# Altium schematic sheet Sheet1.SchDoc
size A4
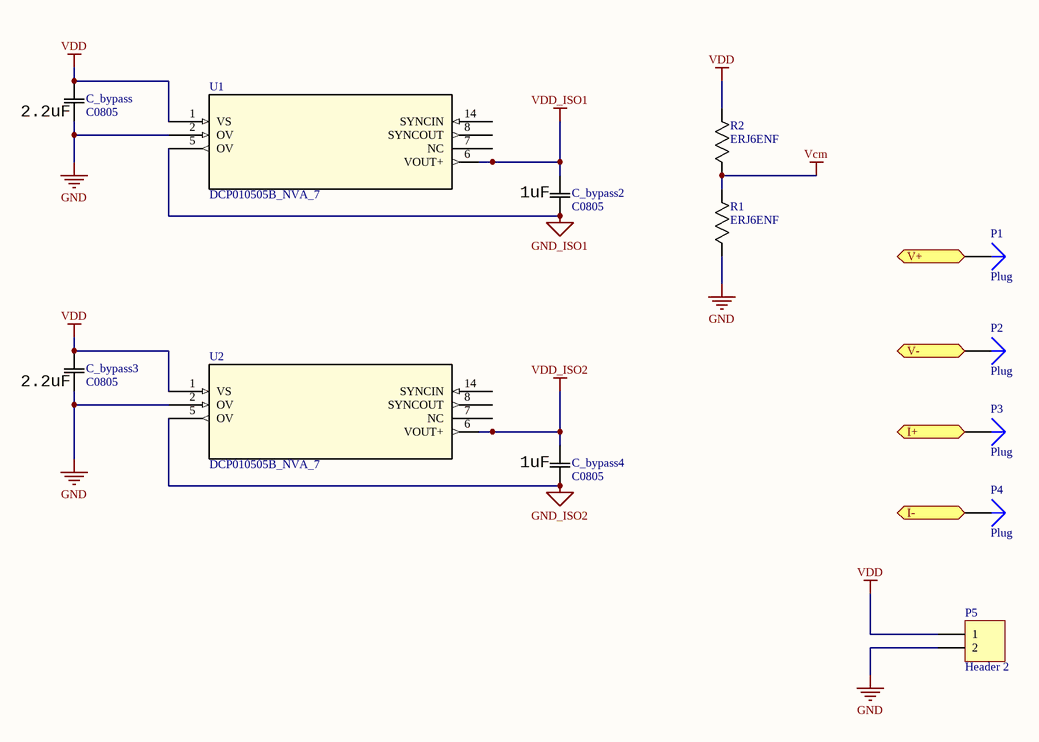
[diagram p0: Sheet1.SchDoc]

## Parts
C_bypass  C0805  value 2.2uF  [C0805C]
C_bypass2  C0805  value 1uF  [C0805C]
C_bypass3  C0805  value 2.2uF  [C0805C]
C_bypass4  C0805  value 1uF  [C0805C]
P1  Plug  [PIN1]
P2  Plug  [PIN1]
P3  Plug  [PIN1]
P4  Plug  [PIN1]
P5  Header 2  [HDR1X2]
R1  ERJ6ENF  [0805]
R2  ERJ6ENF  [0805]
U1  DCP010505B_NVA_7  [NVA7]
U2  DCP010505B_NVA_7  [NVA7]

## Ports
I+ (bidir), I- (bidir), V+ (bidir), V- (bidir)

## Nets
GND: C_bypass.2 C_bypass3.2 P5.2 R1.1 U1.2(OV) U2.2(OV)
GND_ISO1: C_bypass2.2 U1.5(OV)
GND_ISO2: C_bypass4.2 U2.5(OV)
Vcm: R1.2 R2.1
VDD: C_bypass.1 C_bypass3.1 P5.1 R2.2 U1.1(VS) U2.1(VS)
VDD_ISO1: C_bypass2.1 U1.6(VOUT+)
VDD_ISO2: C_bypass4.1 U2.6(VOUT+)
I+: P3.1 ; port I+
I-: P4.1 ; port I-
V+: P1.1 ; port V+
V-: P2.1 ; port V-

Not connected (* = marked no-connect by the designer): U1 7(NC) 8(SYNCOUT) 14(SYNCIN); U2 7(NC) 8(SYNCOUT) 14(SYNCIN)

## Library data of the parts
C_bypass C_bypass2-C_bypass4 = C0805: Imported; Manufacturer_Part_Number: C0805C100C1GACTU; Vendor: Kemet; Built_By: EMA_UL_Team; C: Copyright (C) 2015 Accelerated Designs. All rights reserved; RefDes: RefDes; Type: DEV
P5 = Header 2: Header, 2-Pin; LatestRevisionDate: 17-Jul-2002; LatestRevisionNote: Re-released for DXP Platform.; Publisher: Altium Limited
R1 R2 = ERJ6ENF: Imported; Manufacturer_Part_Number: ERJ6ENF1000V; Vendor: Panasonic; Built_By: EMA_UL_Team; C: Copyright (C) 2016 Accelerated Designs. All rights reserved; RefDes: RefDes; Type: DEV; Value: Value
U1 U2 = DCP010505B_NVA_7: Imported; Manufacturer: Texas Instruments; Built_By: EMA_UL_Team; C: Copyright (C) 2015 Accelerated Designs. All rights reserved; Manufacturer_Part_Number: DCP010505B_NVA_7; Vendor: Texas Instruments; RefDes: RefDes; Type: DEV; Value: Value
P1-P4 = Plug: LatestRevisionDate: 17-Jul-2002; LatestRevisionNote: Re-released for DXP Platform.; Publisher: Altium Limited